# EAGLE schematic Main-Board (EAGLE 8.0.0)
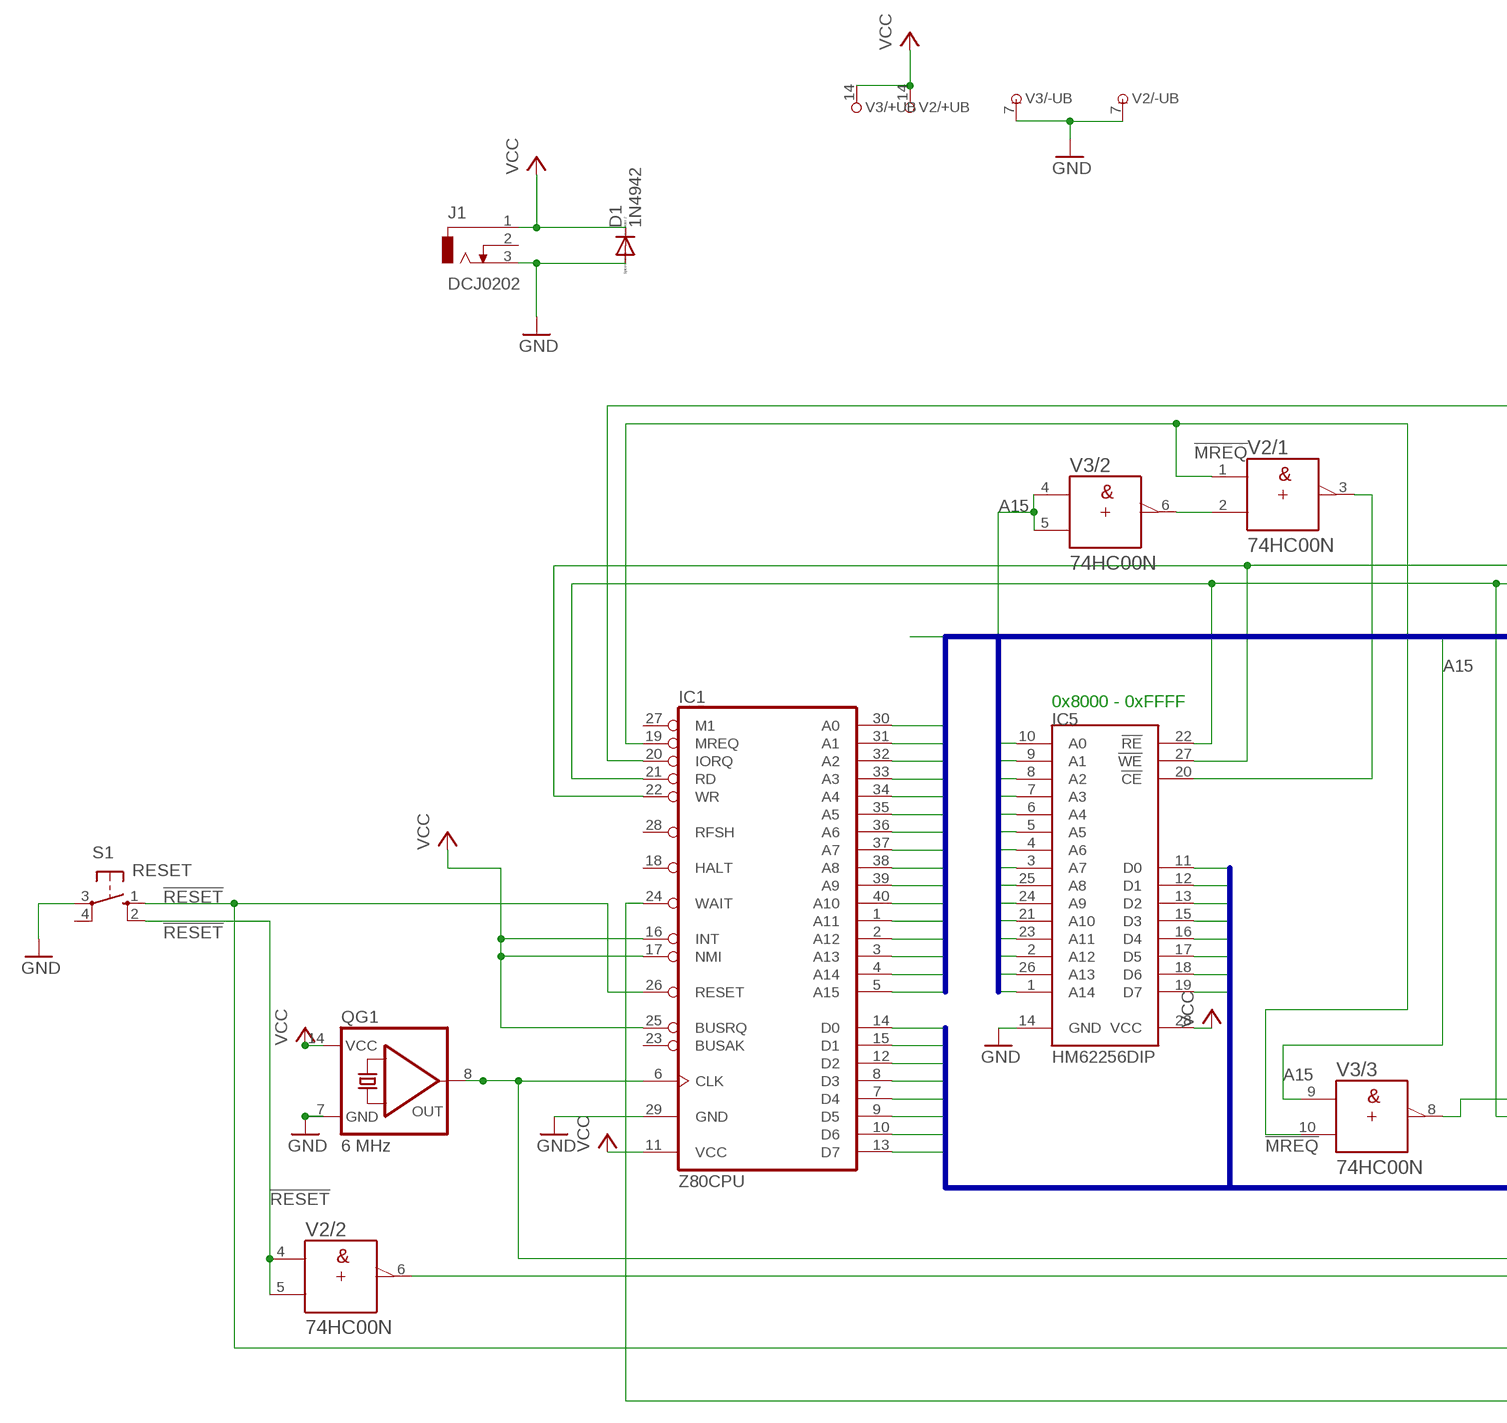
[diagram p0: schematic, sheet 1, part 1 of 2]
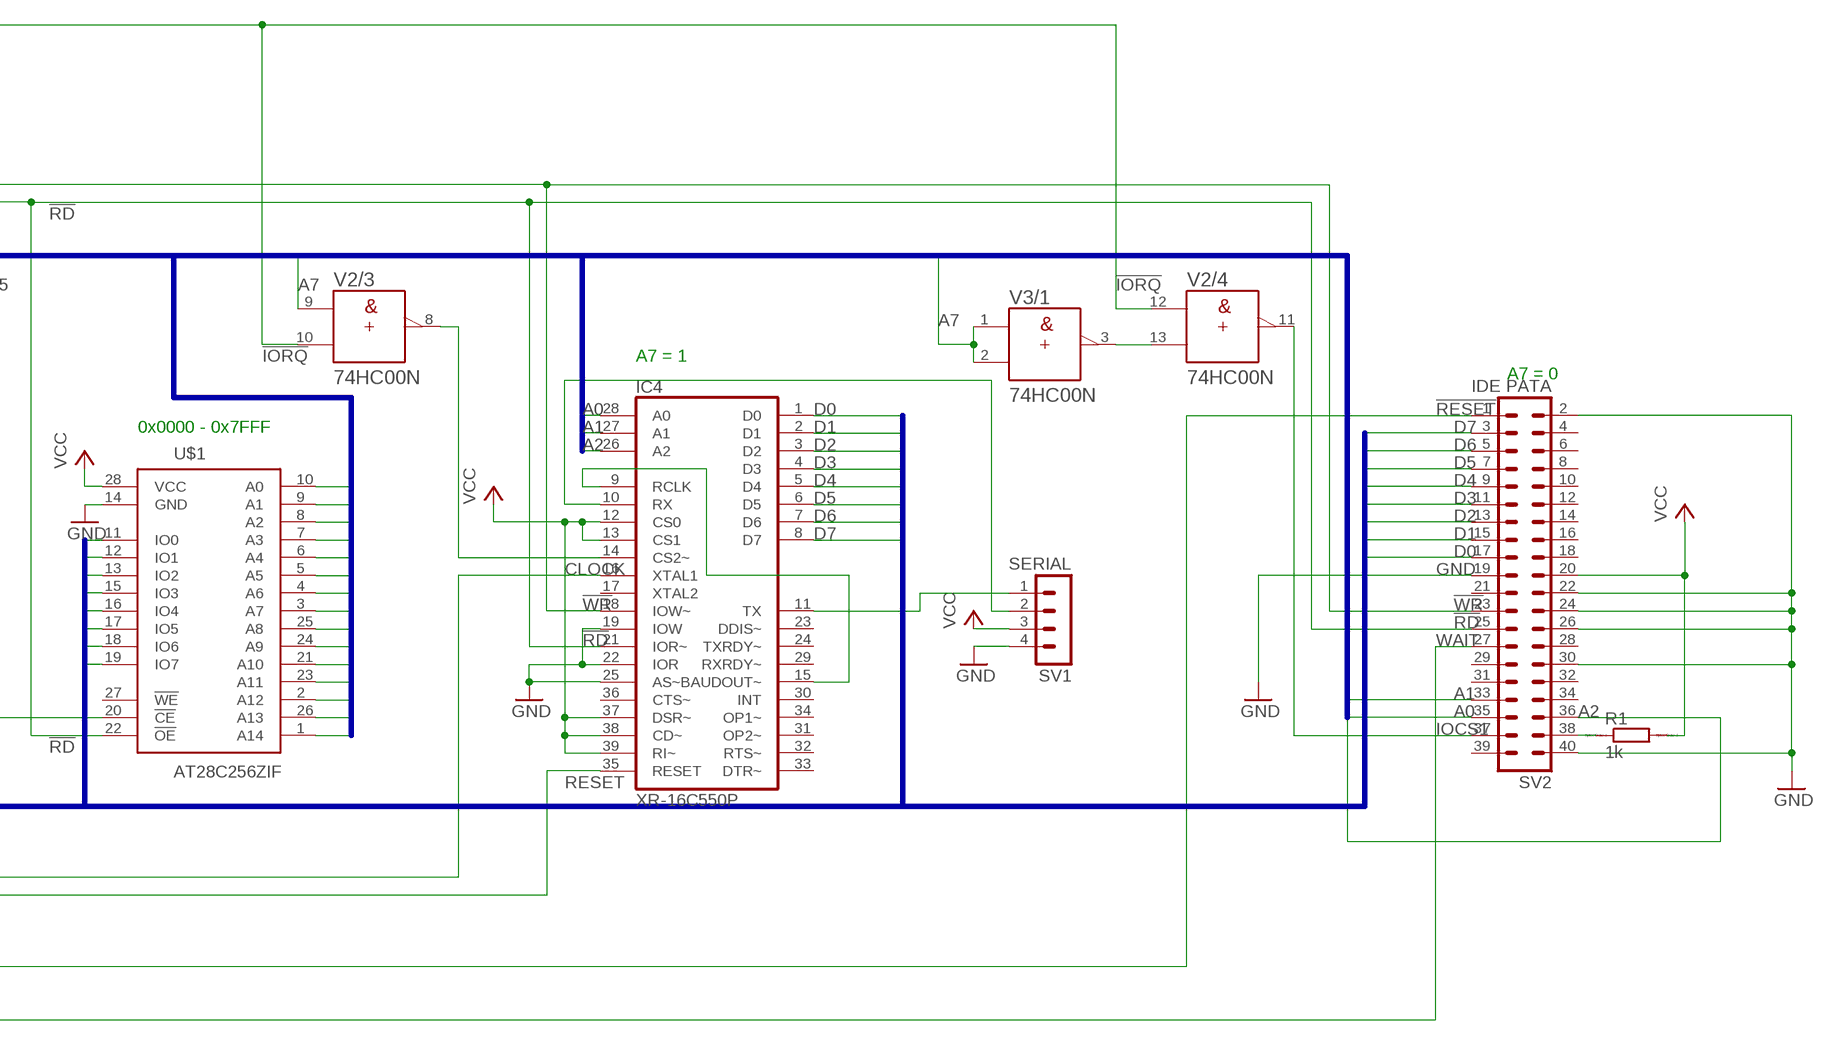
[diagram p1: schematic, sheet 1, part 2 of 2]

## Parts
D1  1N4942  [DO41-10]
IC1  Z80CPU  [DIL40]
IC4  XR-16C550P  [DIL40]
IC5  HM62256DIP  [HM62256-DIP]
J1  DCJ0202  [DCJ0202]
QG1  6 MHz  QG5860  [DIL14S]
R1  1k  R0207/10  [0207/10]
S1  RESET  10-XX  [B3F-10XX]
SV1  SERIAL  MA04-1  [MA04-1]
SV2  IDE PATA  MA20-2  [MA20-2]
U$1  AT28C256ZIF  [DIL28-ZIF]
V2  74HC00N  [DIL14]
V3  74HC00N  [DIL14]

## Nets
!IORQ: IC1.20(IORQ) V2.10(/3:B) V2.12(/4:A)
!MREQ: IC1.19(MREQ) V2.1(/1:A) V3.10(/3:B)
!RD: IC1.21(RD) IC4.21(IOR~) IC5.22(!RE) SV2.25 U$1.22(!OE)
!RESET: IC1.26(RESET) S1.1(S) S1.2(S1) SV2.1 V2.4(/2:A) V2.5(/2:B)
!WR: IC1.22(WR) IC4.18(IOW~) IC5.27(!WE) SV2.23
A0: IC1.30(A0) IC4.28(A0) IC5.10(A0) SV2.35 U$1.10(A0)
A1: IC1.31(A1) IC4.27(A1) IC5.9(A1) SV2.33 U$1.9(A1)
A2: IC1.32(A2) IC4.26(A2) IC5.8(A2) SV2.36 U$1.8(A2)
A3: IC1.33(A3) IC5.7(A3) U$1.7(A3)
A4: IC1.34(A4) IC5.6(A4) U$1.6(A4)
A5: IC1.35(A5) IC5.5(A5) U$1.5(A5)
A6: IC1.36(A6) IC5.4(A6) U$1.4(A6)
A7: IC1.37(A7) IC5.3(A7) U$1.3(A7) V2.9(/3:A) V3.1(/1:A) V3.2(/1:B)
A8: IC1.38(A8) IC5.25(A8) U$1.25(A8)
A9: IC1.39(A9) IC5.24(A9) U$1.24(A9)
A10: IC1.40(A10) IC5.21(A10) U$1.21(A10)
A11: IC1.1(A11) IC5.23(A11) U$1.23(A11)
A12: IC1.2(A12) IC5.2(A12) U$1.2(A12)
A13: IC1.3(A13) IC5.26(A13) U$1.26(A13)
A14: IC1.4(A14) IC5.1(A14) U$1.1(A14)
A15: IC1.5(A15) V3.4(/2:A) V3.5(/2:B) V3.9(/3:A)
CLOCK: IC1.6(CLK) IC4.16(XTAL1) QG1.8(OUT)
D0: IC1.14(D0) IC4.1(D0) IC5.11(D0) SV2.17 U$1.11(IO0)
D1: IC1.15(D1) IC4.2(D1) IC5.12(D1) SV2.15 U$1.12(IO1)
D2: IC1.12(D2) IC4.3(D2) IC5.13(D2) SV2.13 U$1.13(IO2)
D3: IC1.8(D3) IC4.4(D3) IC5.15(D3) SV2.11 U$1.15(IO3)
D4: IC1.7(D4) IC4.5(D4) IC5.16(D4) SV2.9 U$1.16(IO4)
D5: IC1.9(D5) IC4.6(D5) IC5.17(D5) SV2.7 U$1.17(IO5)
D6: IC1.10(D6) IC4.7(D6) IC5.18(D6) SV2.5 U$1.18(IO6)
D7: IC1.13(D7) IC4.8(D7) IC5.19(D7) SV2.3 U$1.19(IO7)
GND: D1.A IC1.29(GND) IC4.19(IOW) IC4.22(IOR) IC4.25(AS~) IC5.14(GND) J1.3 QG1.7(GND) S1.3(P) SV1.4 SV2.2 SV2.19 SV2.22 SV2.24 SV2.26 SV2.30 SV2.40 U$1.14(GND) V2.7(/-UB:-UB) V3.7(/-UB:-UB)
IOCS1: SV2.37 V2.11(/4:Y)
N$2: U$1.20(!CE) V3.8(/3:Y)
N$4: V2.2(/1:B) V3.6(/2:Y)
N$9: IC5.20(!CE) V2.3(/1:Y)
N$11: IC4.11(TX) SV1.1
N$13: IC4.9(RCLK) IC4.15(BAUDOUT~)
N$15: IC4.10(RX) SV1.2
N$17: V2.13(/4:B) V3.3(/1:Y)
N$18: IC4.14(CS2~) V2.8(/3:Y)
N$20: R1.1 SV2.38
RESET: IC4.35(RESET) V2.6(/2:Y)
VCC: D1.C IC1.11(VCC) IC1.16(INT) IC1.17(NMI) IC1.25(BUSRQ) IC4.12(CS0) IC4.13(CS1) IC4.37(DSR~) IC4.38(CD~) IC4.39(RI~) IC5.28(VCC) J1.1 QG1.14(VCC) R1.2 SV1.3 SV2.20 U$1.28(VCC) V2.14(/+UB:+UB) V3.14(/+UB:+UB)
WAIT: IC1.24(WAIT) SV2.27
Unconnected: IC1.18(HALT) IC1.23(BUSAK) IC1.27(M1) IC1.28(RFSH) IC4.17(XTAL2) IC4.23(DDIS~) IC4.24(TXRDY~) IC4.29(RXRDY~) IC4.30(INT) IC4.31(OP2~) IC4.32(RTS~) IC4.33(DTR~) IC4.34(OP1~) IC4.36(CTS~) J1.2 S1.4(P1) SV2.4 SV2.6 SV2.8 SV2.10 SV2.12 SV2.14 SV2.16 SV2.18 SV2.21 SV2.28 SV2.29 SV2.31 SV2.32 SV2.34 SV2.39 U$1.27(!WE) V3.11(/4:Y) V3.12(/4:A) V3.13(/4:B)

## Buses
A[0..15]
D[0..7]

## Notes on the sheet
- 0x8000 - 0xFFFF
- A7 = 1
- A7 = 0
- 0x0000 - 0x7FFF

## Power pins joined to a net without a drawn wire
GND: IC4.20(GND)
VCC: IC4.40(VCC)

## Library data of the parts
D1 = diode:1N4942: DIODE 1.0 A, 200 V, 150 ns; MF: ON SEMICONDUCTOR; MPN: 1N4935G; OC_FARNELL: 1126305
IC1 = zilog:Z80CPU: Z80 FAMILY DEVICE; OC_FARNELL: unknown
IC4 = exar:XR-16C550P: UART/FIFO; OC_FARNELL: unknown; OC_NEWARK: 24R1445
IC5 = jean:HM62256: The HM62256 is a high performance, high speed and super low power CMOS Static Random Access Memory organized as 32,768 words by 8bits and operates for a single 4.5 to 5.5V supply voltage. Advanced CMOS technology and circuit techniques provide both high speed, super low power features and maximum access time of 55/70ns in 5.0V operation. Easy memory expansion is provided by an active LOW chip enable (/CE) and active LOW output enable (/OE). The HM62256 has an automatic power down feature, reducing the power consumption significantly when chip is deselected. The HM62256 is available in JEDEC standard 28-pin SOP (330 mil) and PDIP (600 mil) packages.; OC_FARNELL: unknown
J1 = con-jack:DCJ0202: DC POWER JACK Source: DCJ0202.pdf; OC_FARNELL: unknown; OC_NEWARK: unknown
QG1 = crystal:QG5860: CRYSTAL RESONATOR; OC_FARNELL: unknown; OC_NEWARK: unknown
R1 = eagle-ltspice:R: RESISTOR, European symbol; MF: MULTICOMP; MPN: MCRE000037; OC_FARNELL: 1700237; SPICEMODEL: NONE; SPICEPREFIX: R
S1 = switch-omron:10-XX: OMRON SWITCH; MF: OMRON ELECTRONIC COMPONENTS; MPN: B3F-1000; OC_FARNELL: 176432; OC_NEWARK: 36M3542
SV1 = con-lstb:MA04-1: PIN HEADER; OC_FARNELL: unknown; OC_NEWARK: unknown
SV2 = con-lstb:MA20-2: PIN HEADER; OC_FARNELL: unknown; OC_NEWARK: unknown
U$1 = bt_memory:AT28C256: EEPROM 32Kx8 256k bit The AT28C256 is a high-performance Electrically Erasable and Programmable Read Only Memory. Its 256K of memory is organized as 32,768 words by 8 bits.
V2 V3 = 74ttl-din:74*00: Quad 2-input NAND gate; MF: TEXAS INSTRUMENTS; MPN: SN74HC00N; OC_FARNELL: 9590889